# Altium project uz_per_voltage_measurement.PrjPcb
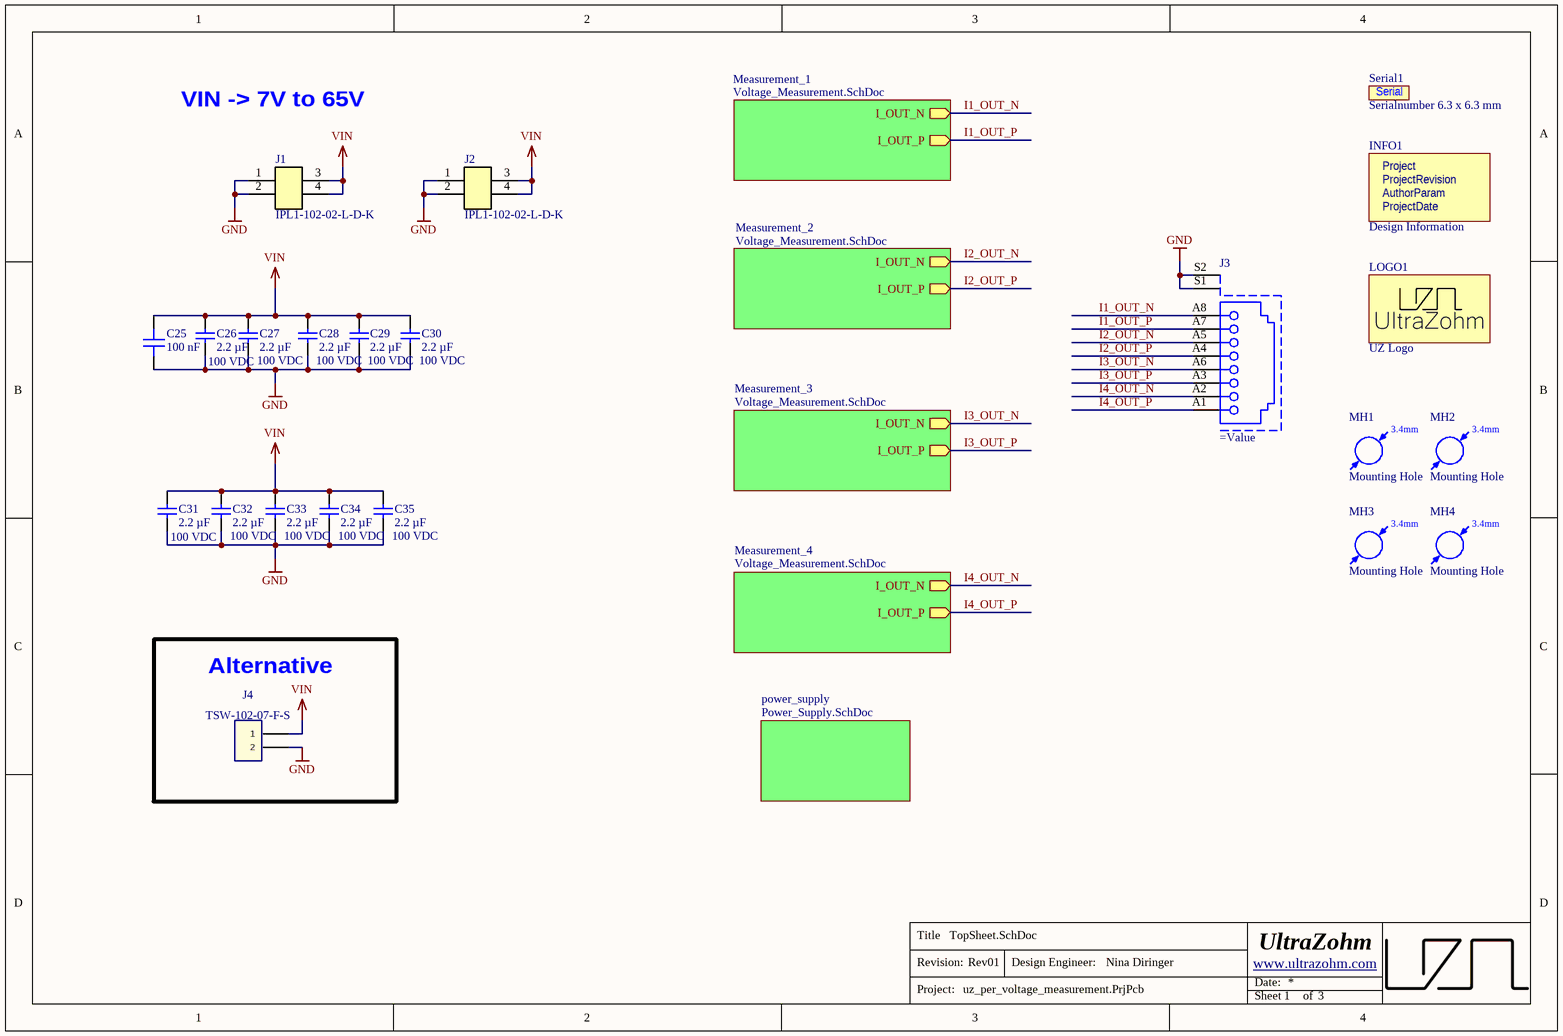
[diagram p0: TopSheet.SchDoc]
ProjectRevision: Rev01; ProjectDate: 09/2025; Project: uz_per_voltage_measurement_box; AuthorParam: Nina Diringer
3 sheets, 257 parts. Net scope: hierarchical (ports join the sheet entries above them; power ports are global).
Board file: uz_per_voltage_measurement.PcbDoc
Sheets:
  TopSheet.SchDoc
    Measurement_1 = Voltage_Measurement.SchDoc
    Measurement_2 = Voltage_Measurement.SchDoc
    power_supply = Power_Supply.SchDoc
    Measurement_3 = Voltage_Measurement.SchDoc
    Measurement_4 = Voltage_Measurement.SchDoc

## Sheet TopSheet.SchDoc
size A4; Author: Nina Diringer; CompanyName: Technische Hochschule Nürnberg Georg Simon Ohm; Organization: UltraZohm; Address1: Kesslerplatz 12; Address2: 90489 Nürnberg; Address3: GERMANY; DocumentNumber: 2; SheetNumber: 1; SheetTotal: 3; Website: www.ultrazohm.com

### Parts
C25  100 nF  [C_0603]
C26  2.2 µF  Voltage Rating: 100 VDC  [C_1210_TE]
C27  2.2 µF  Voltage Rating: 100 VDC  [C_1210_TE]
C28  2.2 µF  Voltage Rating: 100 VDC  [C_1210_TE]
C29  2.2 µF  Voltage Rating: 100 VDC  [C_1210_TE]
C30  2.2 µF  Voltage Rating: 100 VDC  [C_1210_TE]
C31  2.2 µF  Voltage Rating: 100 VDC  [C_1210_TE]
C32  2.2 µF  Voltage Rating: 100 VDC  [C_1210_TE]
C33  2.2 µF  Voltage Rating: 100 VDC  [C_1210_TE]
C34  2.2 µF  Voltage Rating: 100 VDC  [C_1210_TE]
C35  2.2 µF  Voltage Rating: 100 VDC  [C_1210_TE]
INFO1  Design Information  [Design_info]  (no BOM)
J1  IPL1-102-02-L-D-K  [IPL1-102-02-L-D-K-0]
J2  IPL1-102-02-L-D-K  [IPL1-102-02-L-D-K-0]
J3  (no value)  [R-RJ45R10P-B000]
J4  TSW-102-07-F-S  [TSW-102-XX-XXX-S]
LOGO1  UZ Logo  [UZ_Logo_small]  (no BOM)
MH1  Mounting Hole  [MH_3.4]  (no BOM)
MH2  Mounting Hole  [MH_3.4]  (no BOM)
MH3  Mounting Hole  [MH_3.4]  (no BOM)
MH4  Mounting Hole  [MH_3.4]  (no BOM)
Serial1  Serialnumber 6.3 x 6.3 mm  [SERIAL_6.3X6.3MM]  (no BOM)

### Blocks framed on the sheet
Alternative: J4

### Sub-sheets
Measurement_1 = Voltage_Measurement.SchDoc: I_OUT_P (out), I_OUT_N (out)
Measurement_2 = Voltage_Measurement.SchDoc: I_OUT_P (out), I_OUT_N (out)
Measurement_3 = Voltage_Measurement.SchDoc: I_OUT_P (out), I_OUT_N (out)
Measurement_4 = Voltage_Measurement.SchDoc: I_OUT_P (out), I_OUT_N (out)
power_supply = Power_Supply.SchDoc: no entries

### Nets
GND: C25.2 C26.2 C27.2 C28.2 C29.2 C30.2 C31.2 C32.2 C33.2 C34.2 C35.2 J1.1 J1.2 J2.1 J2.2 J3.S1 J3.S2 J4.2
VIN: C25.1 C26.1 C27.1 C28.1 C29.1 C30.1 C31.1 C32.1 C33.1 C34.1 C35.1 J1.3 J1.4 J2.3 J2.4 J4.1
I1_OUT_N: J3.A8 ; sheet Measurement_1/I_OUT_N
I1_OUT_P: J3.A7 ; sheet Measurement_1/I_OUT_P
I2_OUT_N: J3.A5 ; sheet Measurement_2/I_OUT_N
I2_OUT_P: J3.A4 ; sheet Measurement_2/I_OUT_P
I3_OUT_N: J3.A6 ; sheet Measurement_3/I_OUT_N
I3_OUT_P: J3.A3 ; sheet Measurement_3/I_OUT_P
I4_OUT_N: J3.A2 ; sheet Measurement_4/I_OUT_N
I4_OUT_P: J3.A1 ; sheet Measurement_4/I_OUT_P

### Notes on the sheet
- VIN -> 7V to 65V
- Title
- Revision:
- Design Engineer:
- Date:
- Project:
- Sheet
- of
- (in symbol Design Information) Project; ProjectRevision; AuthorParam; ProjectDate
- (in symbol Mounting Hole) 3.4mm
- (in symbol Serial Number) Serial

### Library data of the parts
C25 = C1608X7S2A104KT000N: 100V 100nF X7S ±10% 0603 Multilayer Ceramic Capacitors MLCC - SMD/SMT ROHS; Manufacturer: TDK; Voltage Rating: 100 VDC; Created from: AGeiger; Value: 100 nF; Supplier 1: LCSC; Supplier Part Number 1: C343025; Tolerance: 10 %; LCSC Part Number: C343025; Manufacturer Part Number: C1608X7S2A104KT000N; PartID: 148; Created On: 20/12/2020 13:54:13; ComponentLink1Description: Datasheet; ComponentLink1URL: https://datasheet.lcsc.com/lcsc/2304140030_TDK-C1608X7S2A104KT000N_C343025.pdf; Component Type: Capacitor 0603; Device Package: 0603; Last Updated: 14/12/2022 12:14:21; Mounting Type: SMD; Operating Temperature: -55 to 125°C; Series: X7R; Type: Capacitor; Live Cycle Status: 1; Stock number: not stored
C26-C35 = FS32X225K101EGG: 100V 2.2uF X7R ±10% 1210 Multilayer Ceramic Capacitors MLCC - SMD/SMT ROHS; Manufacturer: PSA(Prosperity Dielectrics); Created from: AGeiger; Manufacturer Part Number: FS32X225K101EGG; PartID: 170; Created On: 11.03.2025 16:22:30; ComponentLink1Description: Datasheet; ComponentLink1URL: https://www.lcsc.com/datasheet/lcsc_datasheet_2410121308_PSA-Prosperity-Dielectrics-FS32X225K101EGG_C153036.pdf; Component Type: Capacitor 1210; Device Package: 1210; Last Updated: 27.05.2025 19:11:48; Mounting Type: SMD; Operating Temperature: -55 to +125°C; Series: FS; Supplier 1: LCSC; Supplier Part Number 1: C153036; Type: Capacitor; Tolerance: 10%; Value: 2.2 µF; Live Cycle Status: 1; LCSC Part Number: C153036
INFO1 = Design Information: Design InformationS; Manufacturer: UltraZohm; Created from: MGremer; Manufacturer Part Number: Design Information; PartID: 12; Created On: 03.11.2021 09:04:23; ComponentLink1Description: https://docs.ultrazohm.com/; ComponentLink1URL: homepage; Component Type: Design Information; Last Updated: 03.11.2021 09:28:34; Supplier 1: -; Supplier Part Number 1: -; Type: Design Information; Value: Design Information; Live Cycle Status: 1
J1 J2 = IPL1-102-02-L-D-K: P=2.54mm Wire To Board Connector ROHS; Manufacturer: SAMTEC; Created from: KIlhan; Number of positions: 2; Manufacturer Part Number: IPL1-102-02-L-D-K; PartID: 59; Created On: 20/03/2025 08:58:37; ComponentLink1Description: Datasheet; ComponentLink1URL: https://wmsc.lcsc.com/wmsc/upload/file/pdf/v2/lcsc/2312312026_Samtec-IPL1-102-02-L-D-K_C7437440.pdf; Component Type: Samtec Connector; Device Package: Connector; Last Updated: 20/03/2025 09:02:48; Mounting Type: THT; Operating Temperature: -55 - +125 °C; Supplier 1: Mouser; Supplier Part Number 1: 200-IPL110202LDK; Supplier 2: LCSC; Supplier Part Number 2: C7437440; Type: Connector; Live Cycle Status: 1; Number of rows: 2; LCSC Part Number: C7437440; Stock number: not stored
J3 = R-RJ45R10P-B000: RJ45Receptacle 1 Shielded Bend insert Without LED 0℃~+70℃ Plugin Ethernet Connectors / Modular Connectors (RJ45 RJ11) ROHS; Manufacturer: Ckmtw(Shenzhen Cankemeng); Created from: KIlhan; Manufacturer Part Number: R-RJ45R10P-B000; PartID: 57; Created On: 20/03/2025 09:19:07; ComponentLink1Description: Datasheet; ComponentLink1URL: https://jlcpcb.com/api/file/downloadByFileSystemAccessId/8588892085580021760; Last Updated: 20/03/2025 13:46:21; Mounting Type: THT; Operating Temperature: 0℃~+70℃; Series: RJ45; Supplier 1: LCSC; Supplier Part Number 1: C386758; Value: R-RJ45R10P-B000; LCSC Part Number: C386758
J4 = TSW-102-07-F-S: Pin Header, 2.54mm, 2x1; MANUFACTURER: SAMTEC; Created from: AGeiger; Number of positions: 2; CREATED BY: May 18, 2016 - Wendy Xin; PCB DECAL: TSW-102-XX-XXX-S; Manufacturer Part Number: TSW-102-07-F-S; PartID: 13; Created On: 02/12/2022 15:20:24; ComponentLink1Description: Datasheet; ComponentLink1URL: https://suddendocs.samtec.com/catalog_english/tsw_th.pdf; Component Type: Pin Header; Device Package: THT; Last Updated: 02/12/2022 15:20:30; Mounting Type: THT; Operating Temperature: -55 to +125 °C; Series: TSW; Supplier 1: Mouser; Supplier Part Number 1: 200-TSW10207FS; Type: Pin Header; Live Cycle Status: 1; Stock number: not stored; Number of rows: 1
LOGO1 = Logo small: Manufacturer: UltraZohm; Created from: MGremer; Created: Jan2021_Liegmann; Value: Logo; Manufacturer Part Number: Logo small; PartID: 10; Created On: 03.11.2021 09:04:23; ComponentLink1Description: https://docs.ultrazohm.com/; ComponentLink1URL: homepage; Component Type: Logo; Last Updated: 03.11.2021 09:05:50; Supplier 1: -; Supplier Part Number 1: -; Type: Logo; Live Cycle Status: 1
MH1-MH4 = Mounting Hole: Created from: MHlatky; Manufacturer Part Number: Mounting Hole; PartID: 16; Created On: 26.01.2021 09:19:51; ComponentLink1Description: Datasheet; Component Type: Mounting Hole; Device Package: -; Last Updated: 21.03.2022 23:05:12; Manufacturer: Mounting Hole; Supplier 1: Mounting Hole; Supplier Part Number 1: Mounting Hole; Type: Mounting Hole; Value: Mounting Hole; Live Cycle Status: 1; Stock number: not stored
Serial1 = Serial Number: Manufacturer: UltraZohm; Value: REV; Created from: MGremer; Created: 2018_09_18_AGeiger; Manufacturer Part Number: Serial Number; PartID: 11; Created On: 03.11.2021 09:04:23; ComponentLink1Description: https://docs.ultrazohm.com/; ComponentLink1URL: homepage; Component Type: Serial Number; Last Updated: 03.11.2021 09:28:34; Supplier 1: -; Supplier Part Number 1: -; Type: Serial Number; Live Cycle Status: 1

## Sheet Voltage_Measurement.SchDoc
size A4; Author: Nina Diringer; CompanyName: Technische Hochschule Nürnberg Georg Simon Ohm; Organization: UltraZohm; Address1: Kesslerplatz 12; Address2: 90489 Nürnberg; Address3: GERMANY; DocumentNumber: 3; SheetNumber: 3; SheetTotal: 3; Website: www.ultrazohm.com
Used 4 times, as channels Measurement_1, Measurement_2, Measurement_3, Measurement_4. Parts and nets are listed once, with the designators drawn on the sheet.
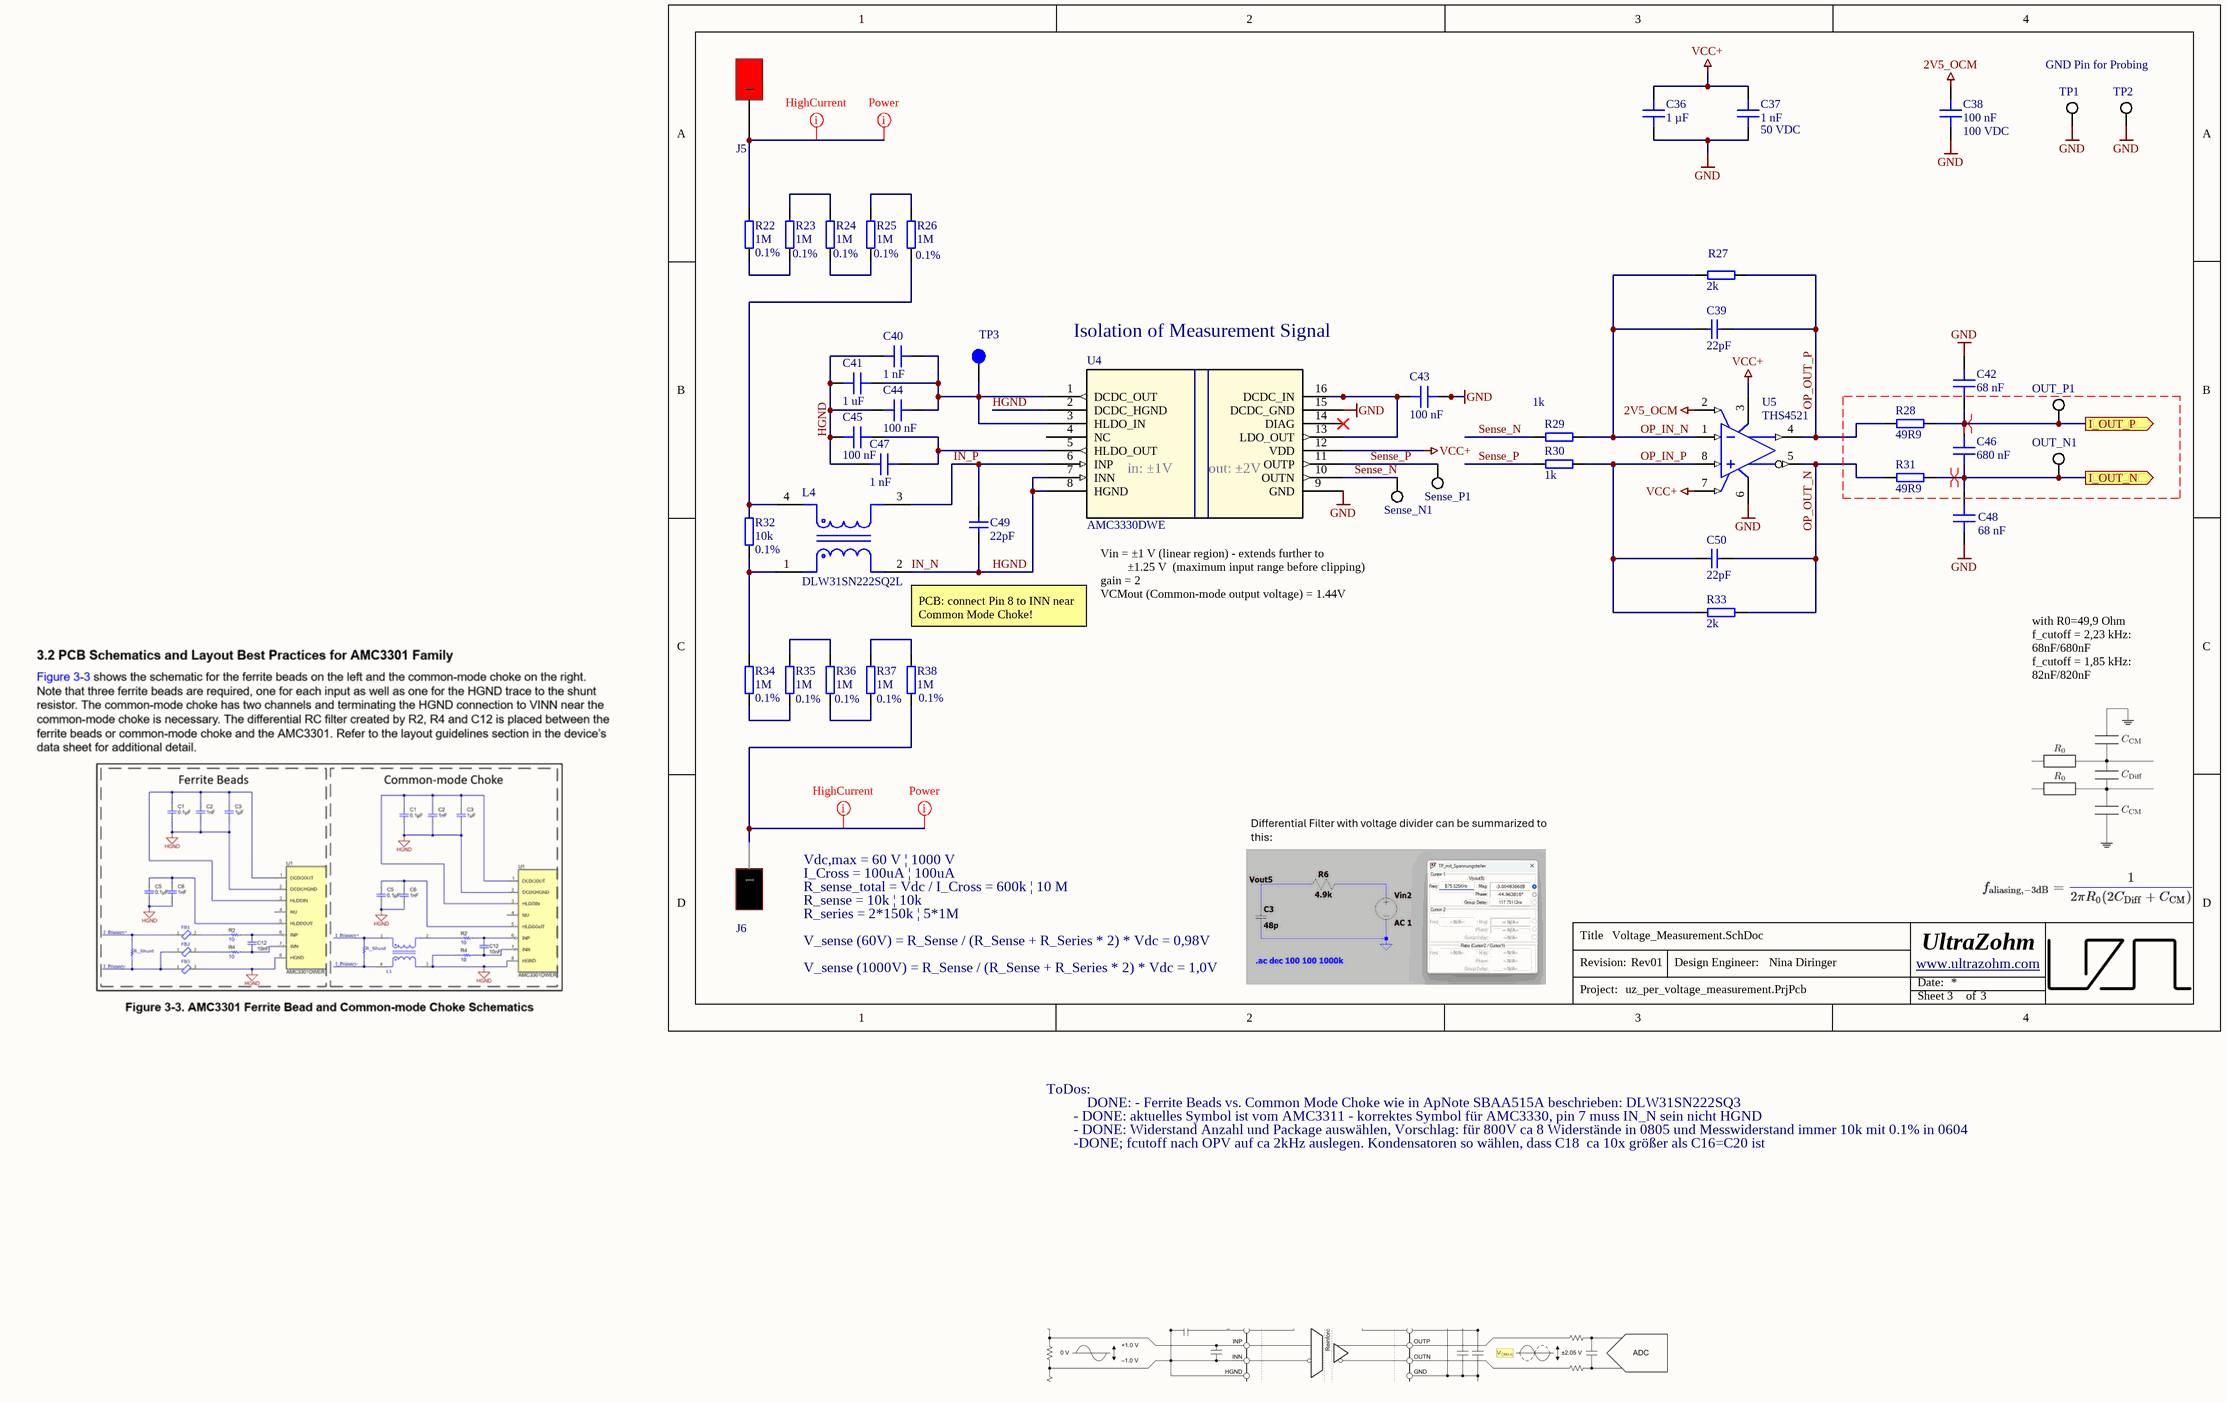
[diagram p1: Voltage_Measurement.SchDoc]

### Parts
C36  1 µF  [C_0603]
C37  1 nF  Voltage Rating: 50 VDC  [C_1206_TE]
C38  100 nF  Voltage Rating: 100 VDC  [C_0603]
C39  22pF  [C_0603_TE]
C40  1 nF  [C_0603_TE]
C41  1 uF  [C_0603]
C42  68 nF  [C_0603_TE]
C43  100 nF  [C_0603]
C44  100 nF  [C_0603]
C45  100 nF  [C_0603]
C46  680 nF  [C_0805_TE]
C47  1 nF  [C_0603_TE]
C48  68 nF  [C_0603_TE]
C49  22pF  [C_0603_TE]
C50  22pF  [C_0603_TE]
J5  FCR7350R, PCB mount 4mm jack, RED  [FCR7350]  (value not drawn)
J6  FCR7350B, PCB mount 4mm jack, BLACK  [FCR7350]  (value not drawn)
L4  DLW31SN222SQ2L  [FP-DLW31S-MFG]
OUT_N1  5015  [KSTN-5019_V]  (value not drawn)
OUT_P1  5015  [KSTN-5019_V]  (value not drawn)
R22  1M  Tolerance: 0.1%  [R_0805_TE]
R23  1M  Tolerance: 0.1%  [R_0805_TE]
R24  1M  Tolerance: 0.1%  [R_0805_TE]
R25  1M  Tolerance: 0.1%  [R_0805_TE]
R26  1M  Tolerance: 0.1%  [R_0805_TE]
R27  2k  [RES 0603_1608]
R28  49R9  [RES 0603_1608]
R29  1k  [RES 0603_1608]
R30  1k  [RES 0603_1608]
R31  49R9  [RES 0603_1608]
R32  10k  Tolerance: 0.1%  [RES 0603_1608]
R33  2k  [RES 0603_1608]
R34  1M  Tolerance: 0.1%  [R_0805_TE]
R35  1M  Tolerance: 0.1%  [R_0805_TE]
R36  1M  Tolerance: 0.1%  [R_0805_TE]
R37  1M  Tolerance: 0.1%  [R_0805_TE]
R38  1M  Tolerance: 0.1%  [R_0805_TE]
Sense_N1  5015  [KSTN-5019_V]  (value not drawn)
Sense_P1  5015  [KSTN-5019_V]  (value not drawn)
TP1  5015  [KSTN-5019_V]  (value not drawn)
TP2  5015  [KSTN-5019_V]  (value not drawn)
TP3  Testpoint 1mm  [TP_1mm]  (value not drawn)  (no BOM)
U4  AMC3330DWE  [SOIC_30DWER_TEX]
U5  THS4521  [ADA4940-1ARZ-R7]

### Ports
I_OUT_N (out), I_OUT_P (out)

### Nets
2V5_OCM: C38.1 U5.2(VOCM)
GND: C36.1 C37.1 C38.2 C42.1 C43.2 C48.2 TP1.1 TP2.1 U4.9(GND) U4.15(DCDC_GND) U5.6(VS-)
VCC+: C36.2 C37.2 U4.12(VDD) U5.3(VS+) U5.7(~{PD})
HGND: C40.1 C41.1 C44.1 C45.1 C47.1 C49.2 L4.2 U4.2(DCDC_HGND) U4.7(INN) U4.8(HGND)  [also labelled IN_N]
I_OUT_N: C46.1 C48.1 OUT_N1.1 R31.2 ; port I_OUT_N
I_OUT_P: C42.2 C46.2 OUT_P1.1 R28.2 ; port I_OUT_P
IN_P: C49.1 L4.3 U4.6(INP)
OP_IN_N: C39.2 R27.1 R29.2 U5.1(VIN-)
OP_IN_P: C50.2 R30.2 R33.1 U5.8(VIN+)
OP_OUT_N: C50.1 R31.1 R33.2 U5.5(VOUT-)
OP_OUT_P: C39.1 R27.2 R28.1 U5.4(VOUT+)
Sense_N: R29.1 Sense_N1.1 U4.10(OUTN)
Sense_P: R30.1 Sense_P1.1 U4.11(OUTP)
NetC40_2: C40.2 C41.2 C44.2 TP3.1 U4.1(DCDC_OUT) U4.3(HLDO_IN)
NetC43_1: C43.1 U4.13(LDO_OUT) U4.16(DCDC_IN)
NetC45_2: C45.2 C47.2 U4.5(HLDO_OUT)
NetJ5_1: J5.1 R22.2
NetJ6_1: J6.1 R38.1
NetL4_1: L4.1 R32.1 R34.2
NetL4_4: L4.4 R26.1 R32.2
NetR22_1: R22.1 R23.1
NetR23_2: R23.2 R24.2
NetR24_1: R24.1 R25.1
NetR25_2: R25.2 R26.2
NetR34_1: R34.1 R35.1
NetR35_2: R35.2 R36.2
NetR36_1: R36.1 R37.1
NetR37_2: R37.2 R38.2

Not connected (* = marked no-connect by the designer): U4 4(NC) 14(DIAG)*

### Channels
Measurement_1: designators end in A; ports I_OUT_N=I1_OUT_N I_OUT_P=I1_OUT_P
Measurement_2: designators end in B; ports I_OUT_N=I2_OUT_N I_OUT_P=I2_OUT_P
Measurement_3: designators end in C; ports I_OUT_N=I3_OUT_N I_OUT_P=I3_OUT_P
Measurement_4: designators end in D; ports I_OUT_N=I4_OUT_N I_OUT_P=I4_OUT_P

### Layout directives
differential pair: I1_OUT_N, I1_OUT_P
net class Power: NetJ5A_1, NetJ6A_1
mark named HighCurrent: NetJ5A_1, NetJ6A_1

### Notes on the sheet
- GND Pin for Probing
- Isolation of Measurement Signal
- (near U4) in: ±1V
- (near U4) out: ±2V
- PCB: connect Pin 8 to INN near Common Mode Choke!
- Vin = ±1 V (linear region) - extends further to
  ±1.25 V  (maximum input range before clipping)
  gain = 2
  VCMout (Common-mode output voltage) = 1.44V
- with R0=49,9 Ohm
  f_cutoff = 2,23 kHz: 68nF/680nF
  f_cutoff = 1,85 kHz: 82nF/820nF
- Vdc,max = 60 V | 1000 V
- I_Cross = 100uA | 100uA
- R_sense_total = Vdc / I_Cross = 600k | 10 M
- R_sense = 10k | 10k
- R_series = 2*150k | 5*1M
- V_sense (60V) = R_Sense / (R_Sense + R_Series * 2) * Vdc = 0,98V
- V_sense (1000V) = R_Sense / (R_Sense + R_Series * 2) * Vdc = 1,0V
- ToDos:
- - DONE: aktuelles Symbol ist vom AMC3311 - korrektes Symbol für AMC3330, pin 7 muss IN_N sein nicht HGND
- DONE: - Ferrite Beads vs. Common Mode Choke wie in ApNote SBAA515A beschrieben: DLW31SN222SQ3
- - DONE: Widerstand Anzahl und Package auswählen, Vorschlag: für 800V ca 8 Widerstände in 0805 und Messwiderstand immer 10k mit 0.1% in 0604
- -DONE; fcutoff nach OPV auf ca 2kHz auslegen. Kondensatoren so wählen, dass C18  ca 10x größer als C16=C20 ist
- Title
- Revision:
- Design Engineer:
- Date:
- Project:
- Sheet
- of

### Library data of the parts
C36 = CL10A105KB8NNNC: 50V 1uF X5R ±10% 0603  Multilayer Ceramic Capacitors MLCC - SMD/SMT ROHS; Manufacturer: Samsung Electro-Mechanics; Voltage Rating: 50 VDC; Created from: MGremer; Manufacturer Part Number: CL10A105KB8NNNC; PartID: 5; Created On: 20.12.2020 13:54:13; ComponentLink1Description: Datasheet; ComponentLink1URL: https://datasheet.lcsc.com/lcsc/1810261812_Samsung-Electro-Mechanics-CL10A105KB8NNNC_C15849.pdf; Component Type: Capacitor 0603; Device Package: 0603; Last Updated: 28.11.2022 17:23:01; Mounting Type: SMD; Operating Temperature: -55 - 85°C; Series: M; Supplier 1: LCSC; Supplier Part Number 1: C15849; Type: Capacitor; Tolerance: 10 %; Value: 1 µF; Live Cycle Status: 1; Stock number: Labor SMD Container; LCSC Part Number: C15849
C37 = CC1206KRX7R9BB102: 1nF 50V X7R ±10% 1206 Multilayer Ceramic Capacitors MLCC - SMD/SMT ROHS; Manufacturer: YAGEO; Created from: NDiringer; Manufacturer Part Number: CC1206KRX7R9BB102; PartID: 505; Created On: 25.08.2025 08:45:14; ComponentLink1Description: Datasheet; ComponentLink1URL: https://jlcpcb.com/partdetail/YAGEO-CC1206KRX7R9BB102/C107207; Component Type: Capacitor 1206; Device Package: 1206; Last Updated: 25.08.2025 08:45:14; Mounting Type: SMD; Operating Temperature: -55 to +125°C; Series: X7R; Supplier 1: JLCPCB; Supplier Part Number 1: C107207; Type: Capacitor; Tolerance: 10 %; Value: 1 nF; Live Cycle Status: 1; Stock number: not stored; Supplier 2: LCSC; Supplier Part Number 2: C107207; LCSC Part Number: C107207
C38 = C1608X7S2A104KT000N: 100V 100nF X7S ±10% 0603 Multilayer Ceramic Capacitors MLCC - SMD/SMT ROHS; Manufacturer: TDK; Created from: AGeiger; Manufacturer Part Number: C1608X7S2A104KT000N; PartID: 148; Created On: 20.12.2020 13:54:13; ComponentLink1Description: Datasheet; ComponentLink1URL: https://datasheet.lcsc.com/lcsc/2304140030_TDK-C1608X7S2A104KT000N_C343025.pdf; Component Type: Capacitor 0603; Device Package: 0603; Last Updated: 14.12.2022 12:14:21; Mounting Type: SMD; Operating Temperature: -55 to 125°C; Series: X7R; Supplier 1: LCSC; Supplier Part Number 1: C343025; Type: Capacitor; Tolerance: 10 %; Value: 100 nF; Live Cycle Status: 1; LCSC Part Number: C343025; Stock number: not stored
C39 C49 C50 = CL10C220JB8NNNC: 50V 22pF C0G ±5% 0603 Multilayer Ceramic Capacitors MLCC - SMD/SMT ROHS; Manufacturer: Samsung Electro-Mechanics; Created from: Kilhan; Manufacturer Part Number: CL10C220JB8NNNC; ComponentLink1Description: Datasheet; ComponentLink1URL: https://jlcpcb.com/api/file/downloadByFileSystemAccessId/8579707043277824000; Series: C0G; Supplier 1: LCSC; Supplier Part Number 1: C1653; Tolerance: 5%; Voltage Rating: 50V; PartID: 172; Created On: 22.06.2025 13:02:55; Component Type: Capacitor 0603; Device Package: 0603; Last Updated: 22.06.2025 13:02:55; Mounting Type: SMD; Operating Temperature: –55 to 125°C; Type: Capacitor; Value: 22pF; Live Cycle Status: 1; Stock number: not stored; LCSC Part Number: C1653
C40 C47 = CC0603KRX7R9BB102: 1nF 50V X7R ±10% 0603 Multilayer Ceramic Capacitors MLCC - SMD/SMT ROHS; Manufacturer: YAGEO; Created from: NDiringer; Voltage Rating: 50 VDC; Manufacturer Part Number: CC0603KRX7R9BB102; PartID: 507; Created On: 25.08.2025 09:10:16; Value: 1 nF; Device Package: 0603; Tolerance: 10 %; Mounting Type: SMD; Last Updated: 25.08.2025 09:34:56; ComponentLink1Description: Datasheet; ComponentLink1URL: https://jlcpcb.com/partdetail/YAGEO-CC0603KRX7R9BB102/C100040; Component Type: Capacitor 0603; Operating Temperature: -55 to +125°C; Series: X7R; Supplier 1: JLCPCB; Supplier Part Number 1: C100040; Supplier 2: LCSC; Supplier Part Number 2: C100040; Type: Capacitor; Live Cycle Status: 1; LCSC Part Number: C100040; Stock number: not stored
C41 = CC0603KRX5R9BB105: 1uF 50V X5R ±10% 0603 Multilayer Ceramic Capacitors MLCC - SMD/SMT ROHS; Manufacturer: YAGEO; Voltage Rating: 50 VDC; Created from: NDiringer; Manufacturer Part Number: CC0603KRX5R9BB105; PartID: 508; Created On: 25.08.2025 09:26:51; ComponentLink1Description: Datasheet; ComponentLink1URL: https://jlcpcb.com/partdetail/YAGEO-CC0603KRX5R9BB105/C128624; Component Type: Capacitor 0603; Device Package: 0603; Last Updated: 25.08.2025 09:28:02; Mounting Type: SMD; Operating Temperature: -55 to +125°C; Series: X7R; Supplier 1: JLCPCB; Supplier Part Number 1: C128624; Supplier 2: LCSC; Supplier Part Number 2: C15849; Type: Capacitor; Tolerance: 10 %; Value: 1 uF; Live Cycle Status: 1; LCSC Part Number: C15849; Stock number: not stored
C42 C48 = CC0603JRX7R9BB683: 50V 68nF X7R ±5% 0603 Multilayer Ceramic Capacitors MLCC - SMD/SMT ROHS; Manufacturer: YAGEO; Voltage Rating: 50 VDC; Created from: NDiringer; Manufacturer Part Number: CC0603JRX7R9BB683; ComponentLink1Description: Datasheet; ComponentLink1URL: https://jlcpcb.com/partdetail/YAGEO-CC0603JRX7R9BB683/C309475; Series: X7R; Supplier 1: JLCPCB; Supplier Part Number 1: C309475; Tolerance: 5 %; PartID: 503; Created On: 14.08.2025 15:37:55; Component Type: Capacitor 0603; Last Updated: 25.08.2025 09:35:07; Mounting Type: SMD; Operating Temperature: -55 to +125°C; Type: Capacitor; Value: 68 nF; Live Cycle Status: 1; Stock number: not stored; LCSC Part Number: C309475; Device Package: 0603
C43-C45 = CC0603KRX7R9BB104: Capacitor 0603, 50 VDC, 100 nF, X7R; Manufacturer: YAGEO; Tolerance: 10 %; Created from: AGeiger; Voltage Rating: 50 VDC; Manufacturer Part Number: CC0603KRX7R9BB104; PartID: 102; Created On: 22.08.2022 14:35:53; Value: 100 nF; Device Package: 0603; Mounting Type: SMD; Last Updated: 22.08.2022 14:35:53; ComponentLink1Description: Datasheet; ComponentLink1URL: https://datasheet.lcsc.com/lcsc/1809301912_YAGEO-CC0603KRX7R9BB104_C14663.pdf; Component Type: Capacitor 0603; Operating Temperature: -55 - 125°C; Series: X7R; Supplier 1: LCSC; Supplier Part Number 1: C14663; Type: Capacitor; Live Cycle Status: 1; LCSC Part Number: C14663; Supplier 2: Mouser; Supplier Part Number 2: 603-CC603KRX7R9BB104
C46 = CC0805KKX7R9BB684: 50V 680nF X7R ±10% 0805 Multilayer Ceramic Capacitors MLCC - SMD/SMT ROHS; Manufacturer: YAGEO; Voltage Rating: 50 VDC; Created from: NDiringer; Manufacturer Part Number: CC0805KKX7R9BB684; ComponentLink1Description: Datasheet; ComponentLink1URL: https://jlcpcb.com/partdetail/YAGEO-CC0805KKX7R9BB684/C107133; Series: X7R; Supplier 1: JLCPCB; Supplier Part Number 1: C107133; Tolerance: 10 %; PartID: 504; Created On: 14.08.2025 15:43:13; Component Type: Capacitor 0805; Device Package: 0805; Last Updated: 14.08.2025 15:43:13; Mounting Type: SMD; Operating Temperature: -55 to +125°C; Type: Capacitor; Value: 680 nF; Live Cycle Status: 1; Stock number: not stored; LCSC Part Number: C107133
J5 = FCR7350R: FCR7350B, 1000V, 24A, RED; Manufacturer: Cliff; Value: PCB mount 4mm jack, Red FCR7350R, 1000V, 24A; Created from: DHufnagel; Manufacturer Part Number: FCR7350R; PartID: 7; Created On: 13.06.2022 10:18:11; ComponentLink1Description: datasheet; ComponentLink1URL: https://www.cliffuk.co.uk/products/testleads/sockets/S16NPC.pdf; ComponentLink2Description: drawing; ComponentLink2URL: https://media.digikey.com/pdf/Data%20Sheets/Cliff%20Electronic%20LTD%20PDF's/FCR7350_Drawing.pdf; Component Type: PCB mount 4mm jack, Red; Device Package: THT; Last Updated: 21.02.2024 15:19:13; Minimum Order: 1; Mounting Type: THT; Operating Temperature: -40°C - 80°C; Series: S16N-PC; Supplier 1: Digi-Key; Supplier Part Number 1: 3185-FCR7350R-ND; Supplier 2: farnell; Supplier Part Number 2: 1854508; Type: PCB mount 4mm jack, Red FCR7350R, 1000V, 24A; Live Cycle Status: 1; Stock number: not stored; Supplier 3: LCSC; Supplier Part Number 3: C7437326; LCSC Part Number: C7437326
J6 = FCR7350B: FCR7350B, 1000V, 24A, BLACK; Manufacturer: Cliff; Value: PCB mount 4mm jack, Black	FCR7350B, 1000V, 24A; Created from: DHufnagel; Manufacturer Part Number: FCR7350B; PartID: 6; Created On: 13.06.2022 10:18:11; ComponentLink1Description: datasheet; ComponentLink1URL: https://www.cliffuk.co.uk/products/testleads/sockets/S16NPC.pdf; ComponentLink2Description: drawing; ComponentLink2URL: https://media.digikey.com/pdf/Data%20Sheets/Cliff%20Electronic%20LTD%20PDF's/FCR7350_Drawing.pdf; Component Type: PCB mount 4mm jack, Black; Device Package: THT; Last Updated: 21.02.2024 15:21:29; Minimum Order: 1; Mounting Type: THT; Operating Temperature: -40°C - 80°C; Series: S16N-PC; Supplier 1: Digi-Key; Supplier Part Number 1: 3185-FCR7350B-ND; Supplier 2: farnell; Supplier Part Number 2: 1854507; Type: PCB mount 4mm jack, Black	FCR7350B, 1000V, 24A; Live Cycle Status: 1; Stock number: not stored; Supplier 3: LCSC; Supplier Part Number 3: C7437327; LCSC Part Number: C7437327
L4 = CMP-06045-000034-1: CMC 200MA 2LN 2.2 KOHM SMD; Number of Lines: 2; Voltage Rating: 50V; Voltage Rating (DC): 125V; DC Resistance (DCR): 1.2R; Impedance: 2.2kR; Shielding: Unshielded; Tolerance: 25%; Insulation Resistance: 10MR; Test Frequency: 100MHz; Depth: 1.8mm; DC Current: 200mA; Case/Package: 1206; Number of Pins: 4; Current Rating: 200mA; Weight: 0.001376oz; Current: 200mA; Packaging: Tape and Reel; Termination: SMD/SMT; Height: 1.9mm; Length: 3.2mm; Military Standard: Not; Package Quantity: 1; Mount: Surface Mount; Max Operating Temperature: 85°C; Max DC Current: 200mA; Radiation Hardening: No; Resistor Type: Wirewound; Lead Free: Lead Free; Case Code (Imperial): 1206; Width: 0.063inch; Min Operating Temperature: -40°C; Self Resonant Frequency: 100MHz; REACH SVHC: No SVHC
OUT_N1 OUT_P1 Sense_N1 Sense_P1 TP1 TP2 = 5015: Circuit Board Hardware - PCB SM TEST POINT ON T&R - MINIATURE; Manufacturer: Keystone Electronics; Value: SMD Testpoint; Created from: AGeiger; Supplier Part Number 1: 534-5015; LCSC Part Number: C5199798; Manufacturer Part Number: 5015; PartID: 26; Created On: 03.06.2023 11:19:55; ComponentLink1Description: Datasheet; ComponentLink1URL: https://www.mouser.de/datasheet/2/215/015-744075.pdf; Component Type: Circuit Board Hardware; Device Package: SMD; Last Updated: 03.06.2023 11:43:17; Mounting Type: SMD; Supplier 1: Mouser; Type: PCB SMD Testpoint; Live Cycle Status: 1; ComponentLink2URL: http://www.keyelco.com/product-pdf.cfm?p=1357; ComponentLink2Description: Datasheet
R22-R26 R34-R38 = RT0805BRD071ML: -55℃~+155℃ 125mW 150V 1MΩ Thin Film Resistor ±0.1% ±25ppm/℃ 0805 Chip Resistor - Surface Mount ROHS; Manufacturer: YAGEO; Created from: NDiringer; Manufacturer Part Number: RT0805BRD071ML; PartID: 377; Created On: 26.08.2025 13:45:09; ComponentLink1Description: Datasheet; ComponentLink1URL: https://jlcpcb.com/partdetail/YAGEO-RT0805BRD071ML/C706228; Component Type: SMD resistor; Device Package: 0805; Last Updated: 26.08.2025 13:57:14; Mounting Type: SMD; Supplier 1: LCSC; Supplier Part Number 1: C706228; Supplier 2: JLCPCB; Supplier Part Number 2: C706228; Type: Resistor; Value: 1M; Live Cycle Status: 1; Stock number: not stored; LCSC Part Number: C706228
R27 R33 = ERJ-PB3B2001V: SMD resistor 0.1%; Manufacturer: Panasonic; Created from: DHufnagel; Manufacturer Part Number: ERJ-PB3B2001V; PartID: 215; Created On: 14.12.2020 16:17:14; ComponentLink1Description: Datasheet; ComponentLink1URL: https://www.mouser.de/datasheet/2/315/AOA0000C328-1530132.pdf; Component Type: SMD resistor; Device Package: 0603; Last Updated: 02.03.2021 14:07:32; Mounting Type: SMD; Supplier 1: Mouser; Supplier Part Number 1: 667-ERJ-PB3B2001V; Type: Resistor; Value: 2k; Live Cycle Status: 1; Stock number: not stored; LCSC Part Number: C728588; Tolerance: 0.1%; Supplier 2: LCSC; Supplier Part Number 2: C728588
R28 R31 = RC0603FR-0749R9L: 100mW Thick Film Resistors ±100ppm/℃ ±1% 49.9Ω 0603 Chip Resistor - Surface Mount ROHS; Manufacturer: YAGEO; Created from: AGeiger; Manufacturer Part Number: RC0603FR-0749R9L; PartID: 277; Created On: 14.06.2023 17:42:26; ComponentLink1Description: Datasheet; ComponentLink1URL: https://datasheet.lcsc.com/lcsc/2304140030_YAGEO-RC0603FR-0749R9L_C114625.pdf; Component Type: SMD resistor; Device Package: 0603; Last Updated: 14.06.2023 17:42:26; Mounting Type: SMD; Supplier 1: LCSC; Supplier Part Number 1: C114625; Type: Resistor; Tolerance: 1%; Value: 49R9; Live Cycle Status: 1; LCSC Part Number: C114625
R29 R30 = AR03BTCX1001: 100mW ±0.1% ±25ppm/℃ 1kΩ 0603 Chip Resistor - Surface Mount ROHS; Manufacturer: Viking Tech; Created from: AGeiger; Manufacturer Part Number: AR03BTCX1001; PartID: 240; Created On: 03.09.2022 10:12:43; ComponentLink1Description: Datasheet; ComponentLink1URL: https://datasheet.lcsc.com/lcsc/2011191435_Viking-Tech-AR03BTCX1001_C304069.pdf; Component Type: SMD resistor; Device Package: 0603; Last Updated: 03.09.2022 10:12:43; Mounting Type: SMD; Supplier 1: LCSC; Supplier Part Number 1: C304069; Type: Resistor; Value: 1k; Live Cycle Status: 1; LCSC Part Number: C304069; Tolerance: 0.1%
R32 = RQ73C1J10KBTD: SMD resistor 0.1%, 10ppm; Manufacturer: TE Connectivity; Created from: DHufnagel; Manufacturer Part Number: RQ73C1J10KBTD; PartID: 231; Created On: 14.12.2020 16:17:14; ComponentLink1Description: Datasheet; ComponentLink1URL: https://www.mouser.de/datasheet/2/418/5/ENG_DS_1773270_2_B-1533717.pdf; Component Type: SMD resistor; Device Package: 0603; Last Updated: 21.02.2024 15:51:17; Mounting Type: SMD; Supplier 1: Mouser; Supplier Part Number 1: 279-RQ73C1J10KBTD; Supplier 2: LCSC; Supplier Part Number 2: C95204; Type: Resistor; Value: 10k; Live Cycle Status: 1; Stock number: not stored; LCSC Part Number: C95204
TP3 = NULL: Manufacturer Part Number: NULL; Created from: AGeiger; Created: 2018_06_25_AGeiger; Value: Testpoint 1mm; PartID: 9; Created On: 20.09.2022 13:14:57; Component Type: Testpoint; Last Updated: 20.09.2022 13:15:39; Manufacturer: NULL; Supplier 1: NULL; Supplier Part Number 1: NULL; Type: Testpoint; Live Cycle Status: 1
U4 = AMC3330DWE: ±1-V input, precision voltage sensing reinforced isolated amplifier with integrated DC/DC; Manufacturer: Texas Instruments; Channels: 1; Created from: NDiringer; Manufacturer Part Number: AMC3330DWE; PartID: 41; Created On: 20.08.2025 13:08:03; ComponentLink1Description: Datasheet; ComponentLink1URL: https://www.ti.com/product/AMC3330; Component Type: Differential Amplifier; Device Package: SOIC-16; Last Updated: 20.08.2025 13:08:03; Mounting Type: SMD; Operating Temperature: -40 to +125 °C; Series: AMC3330; Supplier 1: LCSC; Supplier Part Number 1: C2999368; Type: Differential Amplifiers; Live Cycle Status: 1; LCSC Part Number: C2999368; Stock number: not stored
U5 = THS4521IDGKR: 145MHz 240uV 700nA Single Channel 95MHz SOIC-8 Differential Amplifiers ROHS; Manufacturer: Texas Instruments; Manufacturer Part Number: THS4521IDR; Min Dual Supply Voltage: 1.5V; Max Dual Supply Voltage: 2.75V; Number of Channels: 1; Voltage Gain: 119dB; Slew Rate: 490V/µs; Max I/O Voltage: 2mV; Max Supply Voltage: 5.5V; Min Supply Voltage: 2.5V; Common Mode Rejection Ratio: 80dB; Operating Supply Voltage: 5V; Nominal Supply Current: 1.14mA; Input Bias Current: 900nA; Output Current per Channel: 55mA; Supplier 1: Mouser; RoHS: Yes; Category: Amplifiers - Op Amps, Buffer, Instrumentation; Stock 1: 12114; Pricing 1: 1=2,55000, 10=2,29000, 25=2,16000, 100=1,78000, 250=1,59000, 500=1,54000, 1000=1,28000, 2500=1,25000, 1=2,83000, 10=2,54000, 25=2,40000, 100=1,98000, 250=1,77000, 500=1,71000 (EUR); Case/Package: SOIC8; Number of Pins: 8; Weight: 0.000935oz; Min Operating Temperature: -40°C; Max Operating Temperature: 85°C; Packaging: Tape and Reel; Unity Gain Bandwidth Product: 95MHz; Bandwidth: 145MHz; Package Quantity: 2500; -3db Bandwidth: 145MHz; Gain Bandwidth Product: 95MHz; Input Offset Voltage (Vos): 2mV; Operating Supply Current: 1.14mA; Power Supply Rejection Ratio (PSRR): 80dB; Number of Circuits: 1; Number of Elements: 1; Number of Amplifiers: 1; Radiation Hardening: No; Lead Free: Lead Free; REACH SVHC: No SVHC; ComponentLink1URL: https://datasheet.ciiva.com/14456/sbos458f-14456592.pdf?src-supplier=Avnet; ComponentLink1Description: old Datasheet; ComponentLink2URL: https://datasheet.ciiva.com/18622/ths4521-18622155.pdf?src-supplier=Digi-Key; ComponentLink2Description: Datasheet; Supplier Part Number 1: 595-THS4521IDR; ComponentLink3Description: Manufacturer; ComponentLink3URL: https://www.ti.com/; LCSC Part Number: C16092

## Sheet Power_Supply.SchDoc
size A4; Author: Nina Diringer; CompanyName: Technische Hochschule Nürnberg Georg Simon Ohm; Organization: UltraZohm; Address1: Kesslerplatz 12; Address2: 90489 Nürnberg; Address3: GERMANY; DocumentNumber: 1; SheetNumber: 2; SheetTotal: 3; Website: www.ultrazohm.com
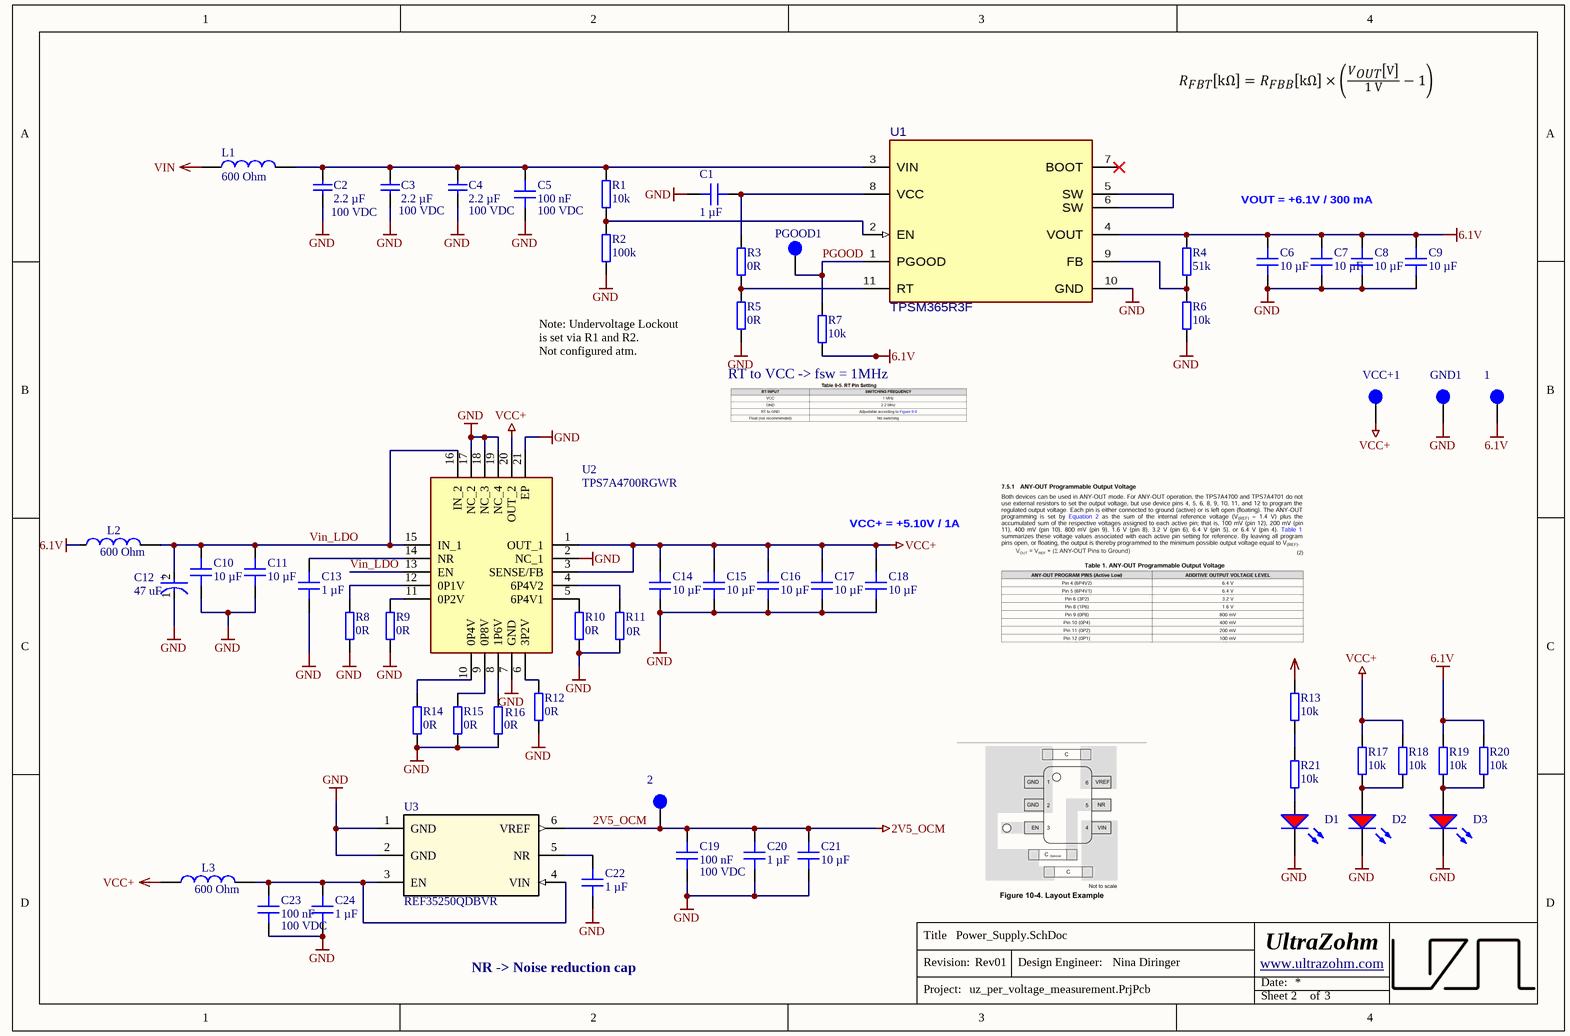
[diagram p2: Power_Supply.SchDoc]

### Parts
1  6.1V  [TP_1mm]  (value not drawn)  (no BOM)
2  2V5  [TP_1mm]  (value not drawn)  (no BOM)
C1  1 µF  [C_0603]
C2  2.2 µF  Voltage Rating: 100 VDC  [C_1210_TE]
C3  2.2 µF  Voltage Rating: 100 VDC  [C_1210_TE]
C4  2.2 µF  Voltage Rating: 100 VDC  [C_1210_TE]
C5  100 nF  Voltage Rating: 100 VDC  [C_0603]
C6  10 µF  [C0805]
C7  10 µF  [C0805]
C8  10 µF  [C0805]
C9  10 µF  [C0805]
C10  10 µF  [C0805]
C11  10 µF  [C0805]
C12  47 uF  [10TPE47MAZB]
C13  1 µF  [C_0603]
C14  10 µF  [C0805]
C15  10 µF  [C0805]
C16  10 µF  [C0805]
C17  10 µF  [C0805]
C18  10 µF  [C0805]
C19  100 nF  Voltage Rating: 100 VDC  [C_0603]
C20  1 µF  [C_0603]
C21  10 µF  [C0805]
C22  1 µF  [C_0603]
C23  100 nF  Voltage Rating: 100 VDC  [C_0603]
C24  1 µF  [C_0603]
D1  KT-0603R  [WL-SMCW_0603]  (value not drawn)
D2  KT-0603R  [WL-SMCW_0603]  (value not drawn)
D3  KT-0603R  [WL-SMCW_0603]  (value not drawn)
GND1  Testpoint 1mm  [TP_1mm]  (value not drawn)  (no BOM)
L1  600 Ohm  [WE-CBF_0805_High Current]
L2  600 Ohm  [WE-CBF_0805_High Current]
L3  600 Ohm  [WE-CBF_0805_High Current]
PGOOD1  Testpoint 1mm  [TP_1mm]  (value not drawn)  (no BOM)
R1  10k  [RES 0603_1608]
R2  100k  [RES 0603_1608]
R3  0R  [RES 0603_1608]
R4  51k  [R_0603_TE]
R5  0R  [RES 0603_1608]
R6  10k  [RES 0603_1608]
R7  10k  [RES 0603_1608]
R8  0R  [RES 0603_1608]
R9  0R  [RES 0603_1608]
R10  0R  [RES 0603_1608]
R11  0R  [RES 0603_1608]
R12  0R  [RES 0603_1608]
R13  10k  [RES 0603_1608]
R14  0R  [RES 0603_1608]
R15  0R  [RES 0603_1608]
R16  0R  [RES 0603_1608]
R17  10k  [RES 0603_1608]
R18  10k  [RES 0603_1608]
R19  10k  [RES 0603_1608]
R20  10k  [RES 0603_1608]
R21  10k  [RES 0603_1608]
U1  TPSM365R3F  [RDN0011A-MFG]
U2  TPS7A4700RGWR  [QFN65P500X500X100-21N-D]
U3  REF35250QDBVR  [TI_SOT23_6-Leads]
VCC+1  VCC+  [TP_1mm]  (value not drawn)  (no BOM)

### Nets
2V5_OCM: 2.1 C19.2 C20.2 C21.2 U3.6(VREF)
6.1V: 1.1 C6.2 C7.2 C8.2 C9.2 L2.1 R4.2 R7.2 R19.1 R20.1 U1.4(VOUT)
GND: C1.2 C2.2 C3.2 C4.2 C5.1 C6.1 C7.1 C8.1 C9.1 C10.1 C11.1 C12.1(C) C13.2 C14.1 C15.1 C16.1 C17.1 C18.1 C19.1 C20.1 C21.1 C22.1 C23.1 C24.1 D1.1(K) D2.1(K) D3.1(K) GND1.1 R2.2 R5.1 R6.2 R8.2 R9.1 R10.1 R11.1 R12.2 R14.1 R15.1 R16.1 U1.10(GND) U2.2(NC_1) U2.7(GND) U2.17(NC_2) U2.18(NC_3) U2.19(NC_4) U2.21(EP) U3.1(GND) U3.2(GND)
VCC+: C14.2 C15.2 C16.2 C17.2 C18.2 L3.1 R17.1 R18.1 U2.1(OUT_1) U2.3(SENSE/FB) U2.20(OUT_2) VCC+1.1
VIN: L1.1 R13.1
PGOOD: PGOOD1.1 R7.1 U1.1(PGOOD)
Vin_LDO: C10.2 C11.2 C12.2(A) L2.2 U2.13(EN) U2.15(IN_1) U2.16(IN_2)
NetC1_1: C1.1 R3.2 U1.8(VCC)
NetC2_1: C2.1 C3.1 C4.1 C5.2 L1.2 R1.2 U1.3(VIN)
NetC13_1: C13.1 U2.14(NR)
NetC22_2: C22.2 U3.5(NR)
NetC23_2: C23.2 C24.2 L3.2 U3.3(EN) U3.4(VIN)
NetD1_2: D1.2(A) R21.2
NetD2_2: D2.2(A) R17.2 R18.2
NetD3_2: D3.2(A) R19.2 R20.2
NetR1_1: R1.1 R2.1 U1.2(EN)
NetR3_1: R3.1 R5.2 U1.11(RT)
NetR4_1: R4.1 R6.1 U1.9(FB)
NetR8_1: R8.1 U2.12(0P1V)
NetR9_2: R9.2 U2.11(0P2V)
NetR10_2: R10.2 U2.5(6P4V1)
NetR11_2: R11.2 U2.4(6P4V2)
NetR12_1: R12.1 U2.6(3P2V)
NetR13_2: R13.2 R21.1
NetR14_2: R14.2 U2.10(0P4V)
NetR15_2: R15.2 U2.9(0P8V)
NetR16_2: R16.2 U2.8(1P6V)
NetU1_5: U1.5(SW) U1.6(SW)

Not connected (* = marked no-connect by the designer): U1 7(BOOT)*

### Notes on the sheet
- VOUT = +6.1V / 300 mA
- Note: Undervoltage Lockout is set via R1 and R2.
  Not configured atm.
- RT to VCC -> fsw = 1MHz
- VCC+ = +5.10V / 1A
- NR -> Noise reduction cap
- Title
- Revision:
- Design Engineer:
- Date:
- Project:
- Sheet
- of
- (in symbol 10TPE47MAZB) +

### Library data of the parts
1 2 VCC+1 = NULL: Testpoint 1mm; Manufacturer Part Number: NULL; Created from: AGeiger; Created: 2018_06_25_AGeiger; Value: Testpoint 1mm; PartID: 9; Created On: 20/09/2022 13:14:57; Component Type: Testpoint; Last Updated: 20/09/2022 13:15:39; Manufacturer: NULL; Supplier 1: NULL; Supplier Part Number 1: NULL; Type: Testpoint; Live Cycle Status: 1
C1 C13 C20 C22 C24 = CL10A105KB8NNNC: as C36 on sheet Voltage_Measurement; Manufacturer Part Number: CL10A105KB8NNNC; PartID: 5; Created On: 20/12/2020 13:54:13; ComponentLink1Description: Datasheet; ComponentLink1URL: https://datasheet.lcsc.com/lcsc/1810261812_Samsung-Electro-Mechanics-CL10A105KB8NNNC_C15849.pdf; Component Type: Capacitor 0603; Device Package: 0603; Last Updated: 28/11/2022 17:23:01; Mounting Type: SMD; Operating Temperature: -55 - 85°C; Series: M; Supplier 1: LCSC; Supplier Part Number 1: C15849; Type: Capacitor; Tolerance: 10 %; Value: 1 µF; Live Cycle Status: 1; Stock number: Labor SMD Container; LCSC Part Number: C15849
C2-C4 = FS32X225K101EGG: as C26 on sheet TopSheet; Manufacturer Part Number: FS32X225K101EGG; PartID: 170; Created On: 11.03.2025 16:22:30; ComponentLink1Description: Datasheet; ComponentLink1URL: https://www.lcsc.com/datasheet/lcsc_datasheet_2410121308_PSA-Prosperity-Dielectrics-FS32X225K101EGG_C153036.pdf; Component Type: Capacitor 1210; Device Package: 1210; Last Updated: 27.05.2025 19:11:48; Mounting Type: SMD; Operating Temperature: -55 to +125°C; Series: FS; Supplier 1: LCSC; Supplier Part Number 1: C153036; Type: Capacitor; Tolerance: 10%; Value: 2.2 µF; Live Cycle Status: 1; LCSC Part Number: C153036
C5 C19 C23 = C1608X7S2A104KT000N: as C38 on sheet Voltage_Measurement; Manufacturer Part Number: C1608X7S2A104KT000N; PartID: 148; Created On: 20.12.2020 13:54:13; ComponentLink1Description: Datasheet; ComponentLink1URL: https://datasheet.lcsc.com/lcsc/2304140030_TDK-C1608X7S2A104KT000N_C343025.pdf; Component Type: Capacitor 0603; Device Package: 0603; Last Updated: 14.12.2022 12:14:21; Mounting Type: SMD; Operating Temperature: -55 to 125°C; Series: X7R; Supplier 1: LCSC; Supplier Part Number 1: C343025; Type: Capacitor; Tolerance: 10 %; Value: 100 nF; Live Cycle Status: 1; LCSC Part Number: C343025; Stock number: not stored
C6-C11 C14-C18 C21 = GRM21BR6YA106KE43L: Capacitor 0805, 35 VDC, 10 µF, X5R; Manufacturer: muRata; Tolerance: 10 %; Voltage Rating: 35 VDC; Created from: MGremer; Manufacturer Part Number: GRM21BR6YA106KE43L; PartID: 28; Created On: 20.12.2020 13:54:13; ComponentLink1Description: Datasheet; ComponentLink1URL: https://www.mouser.de/datasheet/2/281/murata_03052018_GRM_Series_1-1310166.pdf; Component Type: Capacitor 0805; Device Package: 0805; Last Updated: 20.12.2020 17:44:37; Mounting Type: SMD; Operating Temperature: -55 - 85°C; Series: GRM; Supplier 1: Mouser; Supplier Part Number 1: 81-GRM21BR6YA106KE3L; Type: Capacitor; Value: 10 µF; Live Cycle Status: 1; Stock number: Labor SMD Container; LCSC Part Number: C162422
C12 = 10TPE47MAZB: Tantalum Capacitors - Polymer 10volts 47uF ESR 35mohm; Manufacturer: Panasonic; Tolerance: 20 %; Voltage Rating: 10 VDC; Created from: Kilhan; Manufacturer Part Number: 10TPE47MAZB; PartID: 173; Created On: 26/06/2025 16:14:36; ComponentLink1Description: Datasheet; ComponentLink1URL: https://industrial.panasonic.com/cdbs/www-data/pdf/AAA8000/AAA8000C36.pdf; Component Type: Tantalum Capacitor; Device Package: 1210 (3528 metric); Last Updated: 26/06/2025 16:39:07; Mounting Type: SMD; Operating Temperature: -55 to +105°C; Series: TPE; Supplier 1: Mouser; Supplier Part Number 1: 667-10TPE47MAZB; Supplier 2: LCSC; Supplier Part Number 2: C147768; Type: Capacitor; Value: 47 uF; Live Cycle Status: 1; LCSC Part Number: C147768; Stock number: not stored
D1-D3 = KT-0603R: LED RED 520~625NM 90~100MCD@20MA TOP VIEW 0603 ROHS; Manufacturer: Hubei KENTO Elec; Type: Standard; Created from: T. Wendt; Forward Current I_f: 20 mA; Forward Voltage U_f: 2.1 V; Wavelength: 620 nm; Light Intensity: 110 mcd; Nominal Power: 42 mW; Manufacturer Part Number: KT-0603R; PartID: 8; Created On: 03/03/2021 10:06:23; ComponentLink1Description: Datasheet; ComponentLink1URL: https://datasheet.lcsc.com/szlcsc/Hubei-KENTO-Elec-KT-0603R_C2286.pdf; Component Type: LED Diode; Device Package: 0603; Last Updated: 04/03/2021 09:02:49; Mounting Type: SMD; Operating Temperature: -40 - 85 °C; Supplier 1: LCSC; Supplier Part Number 1: C2286; Live Cycle Status: 1; Stock number: not stored; Color: red; LCSC Part Number: C2286
GND1 PGOOD1 = NULL: as TP3 on sheet Voltage_Measurement; Created: 2018_06_25_AGeiger; Value: Testpoint 1mm; PartID: 9; Component Type: Testpoint; Manufacturer: NULL; Supplier 1: NULL; Supplier Part Number 1: NULL; Type: Testpoint; Live Cycle Status: 1
  GND1: Created On: 20/09/2022 13:14:57; Last Updated: 20/09/2022 13:15:39
  PGOOD1: Created On: 20.09.2022 13:14:57; Last Updated: 20.09.2022 13:15:39
L1-L3 = 742792040: Inductance, 0805, 100 MHz, 600 Ohm, 2 A; Manufacturer: Wuerth Elektronik; Type: Inductance SMD; DC current: 2 A; Created from: AGeiger; ComponentLink1Description: Datasheet; ComponentLink1URL: https://www.mouser.de/datasheet/2/445/742792040-1720361.pdf; Value: 600 Ohm; Supplier 1: Mouser; Supplier Part Number 1: 710-742792040; LCSC Part Number: C2661857; Manufacturer Part Number: 742792040; PartID: 1; Created On: 18/01/2021 14:53:17; Component Type: Inductance; Device Package: 0805; Last Updated: 22/08/2024 07:43:45; Mounting Type: SMD; Operating Temperature: -55 - 125 °C; Series: WE-CBF; Live Cycle Status: 1; Stock number: not stored
R1 R6 R7 R13 R17-R21 = 0603WAF1002T5E: SMD resistor 1%; Manufacturer: UNI-ROYAL; Created from: AGeiger; Manufacturer Part Number: 0603WAF1002T5E; PartID: 265; Created On: 01/06/2023 06:49:29; Value: 10k; Device Package: 0603; Tolerance: 1%; Mounting Type: SMD; Last Updated: 01/06/2023 06:49:29; ComponentLink1Description: Datasheet; ComponentLink1URL: https://datasheet.lcsc.com/lcsc/2206010045_UNI-ROYAL-Uniroyal-Elec-0603WAF1002T5E_C25804.pdf; Component Type: SMD resistor; Supplier 1: LCSC; Supplier Part Number 1: C25804; Type: Resistor; Live Cycle Status: 1; LCSC Part Number: C25804
R2 = CRCW0603100KFKEAC: SMD resistor 1%; Manufacturer: Vishay; Created from: MGremer; Manufacturer Part Number: CRCW0603100KFKEAC; PartID: 181; Created On: 14/12/2020 16:17:14; Value: 100k; Device Package: 0603; Tolerance: 1%; Mounting Type: SMD; Last Updated: 21/05/2021 10:03:40; ComponentLink1Description: Datasheet; ComponentLink1URL: https://www.mouser.de/datasheet/2/427/crcwce3-1762584.pdf; Component Type: SMD resistor; Supplier 1: Mouser; Supplier Part Number 1: 71-CRCW0603100KFKEAC; Type: Resistor; Live Cycle Status: 1; Stock number: not stored
R3 R5 R8-R12 R14-R16 = RC0603JR-070RL: SMD resistor E24 series; Manufacturer: YAGEO; Tolerance: 5%; Created from: MGremer; Manufacturer Part Number: RC0603JR-070RL; PartID: 1; Created On: 14/12/2020 16:17:14; ComponentLink1Description: Datasheet; ComponentLink1URL: https://www.mouser.de/datasheet/2/447/PYu-RC_Group_51_RoHS_L_10-1664068.pdf; Component Type: SMD resistor; Device Package: 0603; Last Updated: 04/03/2021 09:09:42; Mounting Type: SMD; Supplier 1: Mouser; Supplier Part Number 1: 603-RC0603JR-070RL; Supplier 2: LCSC; Supplier Part Number 2: C21189; Type: Resistor; Value: 0R; Live Cycle Status: 1; Stock number: Labor SMD Container; LCSC Part Number: C21189
R4 = 0603WAF5102T5E: 100mW Thick Film Resistors 75V ±100ppm/℃ ±1% 51kΩ 0603 Chip Resistor - Surface Mount ROHS; Manufacturer: UNI-ROYAL(Uniroyal Elec); Created from: KIlhan; Manufacturer Part Number: 0603WAF5102T5E; PartID: 363; Created On: 16/06/2025 17:07:49; ComponentLink1Description: Datasheet; ComponentLink1URL: https://jlcpcb.com/api/file/downloadByFileSystemAccessId/8579706288655699968; Component Type: SMD resistor; Device Package: 0603; Last Updated: 18/06/2025 13:28:44; Mounting Type: SMD; Supplier 1: LCSC; Supplier Part Number 1: C23196; Type: Resistor; Tolerance: 1%; Value: 51k; Live Cycle Status: 1; Stock number: not stored; LCSC Part Number: C23196
U1 = TPSM365R6FRDNR: 3-V to 65-V input, 1-V to 13-V output, 0.6-A synchronous buck converter power module; Manufacturer Part Number: TPSM365R3FRDNR; Manufacturer: Texas Instruments; Created from: KIlhan; PartID: 42; Created On: 16/06/2025 17:12:20; ComponentLink1Description: Datasheet; ComponentLink1URL: https://www.ti.com/lit/ds/symlink/tpsm365r3.pdf?ts=1747982141267; Component Type: Power module with inductor; Device Package: QFN-FCMOD; Last Updated: 16/06/2025 17:12:20; Mounting Type: SMD; Operating Temperature: -40 to +125 °C; Series: TPSM365; Supplier 1: LCSC; Supplier Part Number 1: C20346006; Type: Power module (integrated inductor); Value: TPSM365R3F; Live Cycle Status: 1; LCSC Part Number: C20346006; Stock number: not stored; Supplier 2: Mouser; Supplier Part Number 2: 595-TPSM365R6FRDNR
U2 = TPS7A4700RGWR: 1-A, 36-V, low-noise, high-PSRR, low-dropout voltage regulator with enable; Manufacturer_Name: Texas Instruments; Geometry.Height: 1mm; Value: 5 V; Created from: KIlhan; Manufacturer_Part_Number: TPS7A4701RGWR; Mouser Part Number: 595-TPS7A4701RGWR; Mouser Price/Stock: https://www.mouser.co.uk/ProductDetail/Texas-Instruments/TPS7A4701RGWR?qs=2YfbMANv382WBl7zEiZ0Og%3D%3D; Arrow Part Number: TPS7A4701RGWR; Arrow Price/Stock: https://www.arrow.com/en/products/tps7a4701rgwr/texas-instruments?utm_currency=USD&region=nac; Datasheet Link: http://www.ti.com/lit/gpn/tps7a47; Manufacturer Part Number: TPS7A4700RGWR; PartID: 20; Created On: 16/06/2025 23:37:46; ComponentLink1Description: Datasheet; ComponentLink1URL: https://www.ti.com/lit/ds/symlink/tps7a47.pdf?ts=1750053970117&ref_url=https%253A%252F%252Fwww.ti.com%252Fproduct%252FTPS7A47%253FkeyMatch%253DTPS7A4701RGWR%2526tisearch%253Duniversal_search%2526usecase%253DOPN-ALT; Component Type: LDO; Device Package: VQFN-20-EP(5x5); Last Updated: 18/06/2025 15:16:15; Manufacturer: Texas Instruments; Mounting Type: SMD; Operating Temperature: -40 to +125 °C; Series: TPS7A47; Supplier 1: Mouser; Supplier Part Number 1: 595-TPS7A4700RGWR; Supplier 2: LCSC; Supplier Part Number 2: C114839; Type: LDO; Live Cycle Status: 1; LCSC Part Number: C114839; Stock number: not stored
U3 = REF35250QDBVR: 2.5V ±0.05% 2.75V~6V 10mA Fixed SOT-23-6 Voltage Reference ROHS; Manufacturer: Texas Instruments; Created from: KIlhan; Manufacturer Part Number: REF35250QDBVR; PartID: 18; Created On: 20/03/2025 09:42:36; ComponentLink1Description: Datasheet; ComponentLink1URL: https://wmsc.lcsc.com/wmsc/upload/file/pdf/v2/lcsc/2311301509_Texas-Instruments-REF35250QDBVR_C6265005.pdf; Component Type: Voltage Reference; Device Package: SMD; Last Updated: 23/03/2025 21:09:34; Mounting Type: SMD; Operating Temperature: -40℃~+125℃; Supplier 1: Mouser; Supplier Part Number 1: 595-REF35250QDBVR; Supplier 2: LCSC; Supplier Part Number 2: C6265005; Type: Voltage Reference; Value: 2.5V; Live Cycle Status: 1; LCSC Part Number: C6265005; Stock number: not stored

## Nets that join several sheets
2V5_OCM: Measurement_1 (C38A.1 U5A.2), Measurement_2 (C38B.1 U5B.2), Power_Supply (5 pins), Measurement_3 (C38C.1 U5C.2), Measurement_4 (C38D.1 U5D.2)
GND: TopSheet (18 pins), Measurement_1 (11 pins), Measurement_2 (11 pins), Power_Supply (48 pins), Measurement_3 (11 pins), Measurement_4 (11 pins)
VCC+: Measurement_1 (5 pins), Measurement_2 (5 pins), Power_Supply (12 pins), Measurement_3 (5 pins), Measurement_4 (5 pins)
VIN: TopSheet (16 pins), Power_Supply (L1.1 R13.1)
I1_OUT_N: TopSheet (J3.A8), Measurement_1 (C46A.1 C48A.1 OUT_N1A.1 R31A.2)
I1_OUT_P: TopSheet (J3.A7), Measurement_1 (C42A.2 C46A.2 OUT_P1A.1 R28A.2)
I2_OUT_N: TopSheet (J3.A5), Measurement_2 (C46B.1 C48B.1 OUT_N1B.1 R31B.2)
I2_OUT_P: TopSheet (J3.A4), Measurement_2 (C42B.2 C46B.2 OUT_P1B.1 R28B.2)
I3_OUT_N: TopSheet (J3.A6), Measurement_3 (C46C.1 C48C.1 OUT_N1C.1 R31C.2)
I3_OUT_P: TopSheet (J3.A3), Measurement_3 (C42C.2 C46C.2 OUT_P1C.1 R28C.2)
I4_OUT_N: TopSheet (J3.A2), Measurement_4 (C46D.1 C48D.1 OUT_N1D.1 R31D.2)
I4_OUT_P: TopSheet (J3.A1), Measurement_4 (C42D.2 C46D.2 OUT_P1D.1 R28D.2)

## Assembly variants
800V: not fitted R2 R5 R9 R10 R11 R15 R16
60V: not fitted R2 R5 R9 R10 R11 R15 R16; alternate parts R23A -> RT0805BRD07150KL, R22A -> RT0805BRD07150KL, R35D -> RT0805BRD07150KL, R34C -> RT0805BRD07150KL, R22B -> RT0805BRD07150KL, R22C -> RT0805BRD07150KL, R22D -> RT0805BRD07150KL, R23B -> RT0805BRD07150KL, R23C -> RT0805BRD07150KL, R23D -> RT0805BRD07150KL, R35C -> RT0805BRD07150KL, R35B -> RT0805BRD07150KL, R35A -> RT0805BRD07150KL, R34D -> RT0805BRD07150KL, R34B -> RT0805BRD07150KL, R34A -> RT0805BRD07150KL